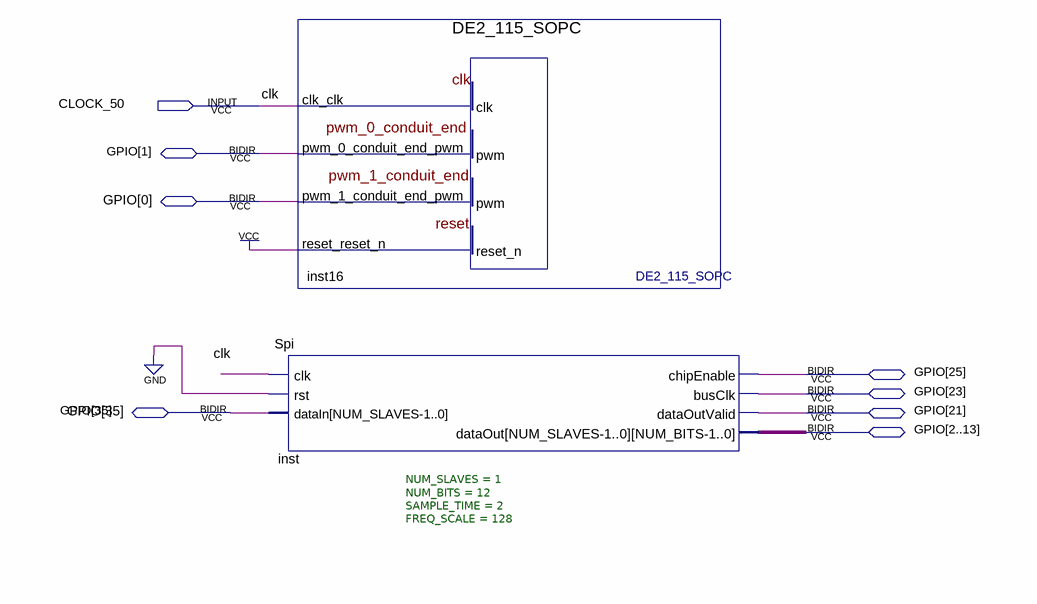
[diagram p0: schematic sheet]
// Quartus schematic Turret.bdf as structural Verilog: 2 symbols, 8 pins
module Turret (
  input  CLOCK_50,
  inout  [0:35] GPIO
);

  Spi #(.NUM_SLAVES(1), .NUM_BITS(12), .SAMPLE_TIME(2), .FREQ_SCALE(128)) inst (
    .clk(CLOCK_50), .rst(1'b0), .dataIn(GPIO[35]), .chipEnable(GPIO[25]), .busClk(GPIO[23]),
    .dataOutValid(GPIO[21]), .dataOut(GPIO[2:13]));
  DE2_115_SOPC inst16 (
    .clk_clk(CLOCK_50), .reset_reset_n(1'b1), .pwm_0_conduit_end_pwm(GPIO[1]), .pwm_1_conduit_end_pwm(GPIO[0]));

  // Other names for the same wires on the sheet: clk = CLOCK_50
endmodule
